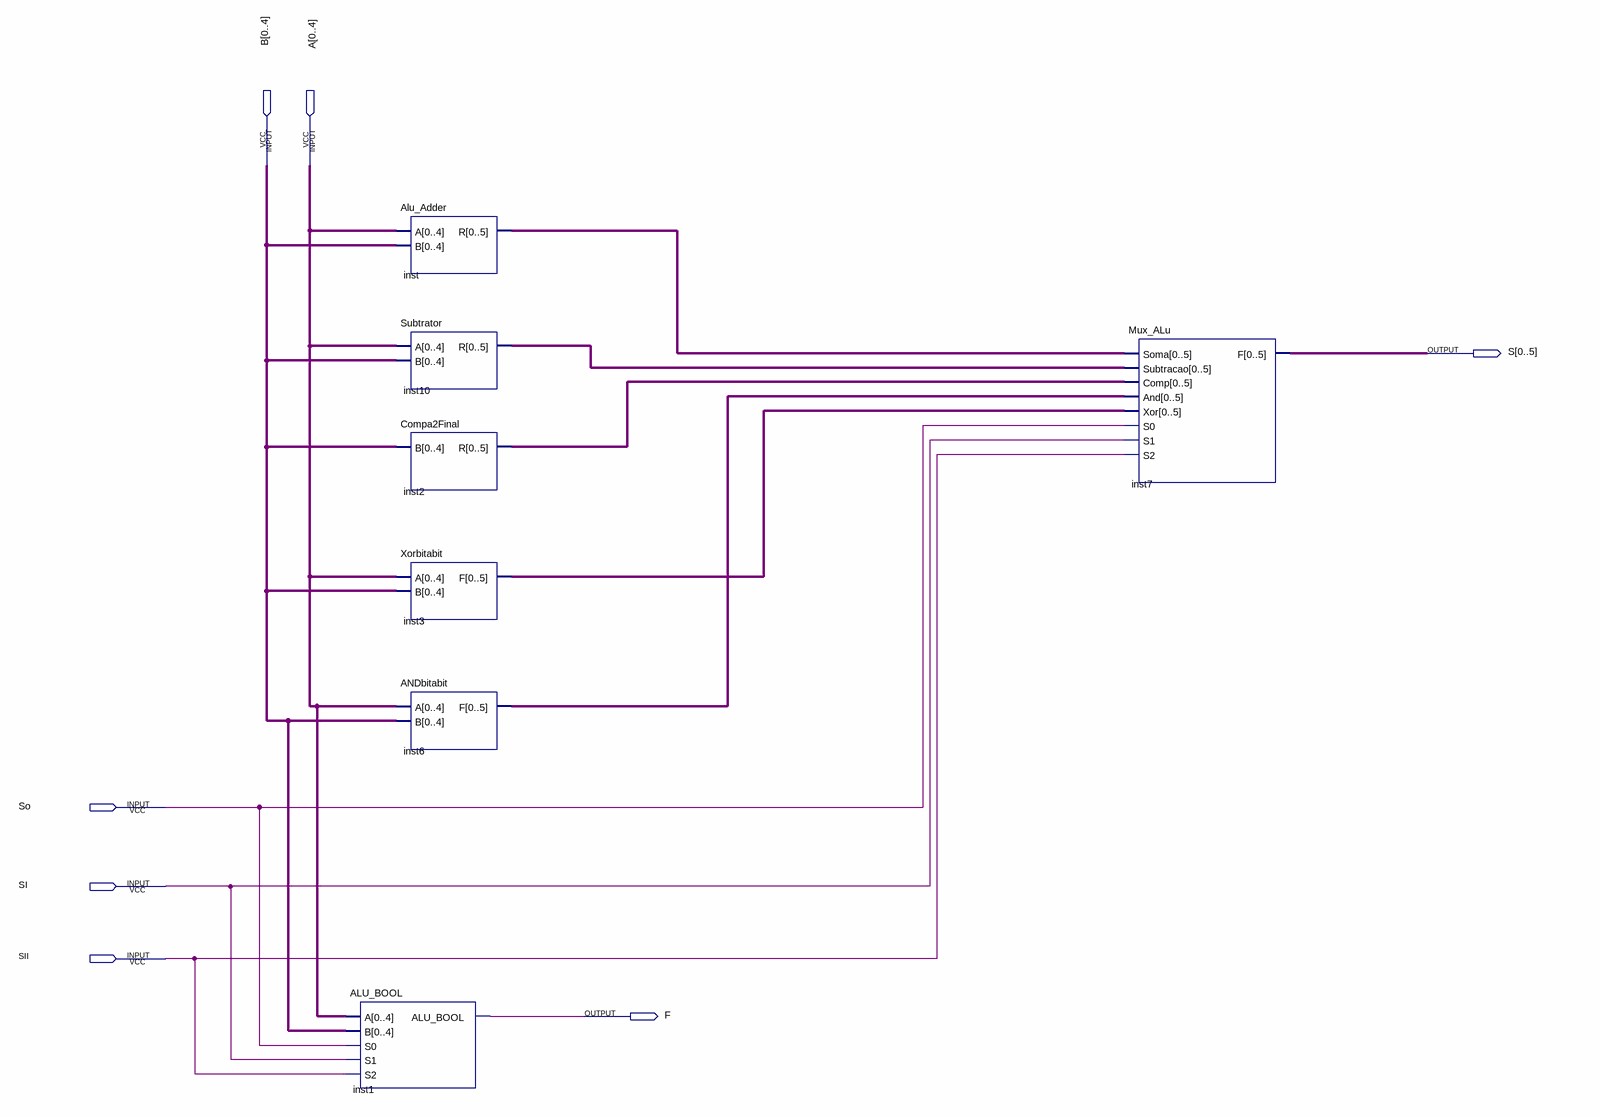
[diagram p0: schematic sheet]
// Quartus schematic AluFinal.bdf as structural Verilog: 7 symbols, 7 pins
module AluFinal (
  input  [0:4] B,
  input  [0:4] A,
  input  So,
  input  SI,
  input  SII,
  output [0:5] S,
  output F
);

  wire [5:0] inst2_r, inst3_f, inst6_f, inst10_r, inst_r;

  ALU_BOOL inst1 (.A(A), .B(B), .S0(So), .S1(SI), .S2(SII), .ALU_BOOL(F));
  Alu_Adder inst (.A(A), .B(B), .R(inst_r));
  Subtrator inst10 (.A(A), .B(B), .R(inst10_r));
  Compa2Final inst2 (.B(B), .R(inst2_r));
  Xorbitabit inst3 (.A(A), .B(B), .F(inst3_f));
  ANDbitabit inst6 (.A(A), .B(B), .F(inst6_f));
  Mux_ALu inst7 (
    .Soma(inst_r), .Subtracao(inst10_r), .Comp(inst2_r), .And(inst6_f), .Xor(inst3_f), .S0(So), .S1(SI),
    .S2(SII), .F(S));
endmodule
